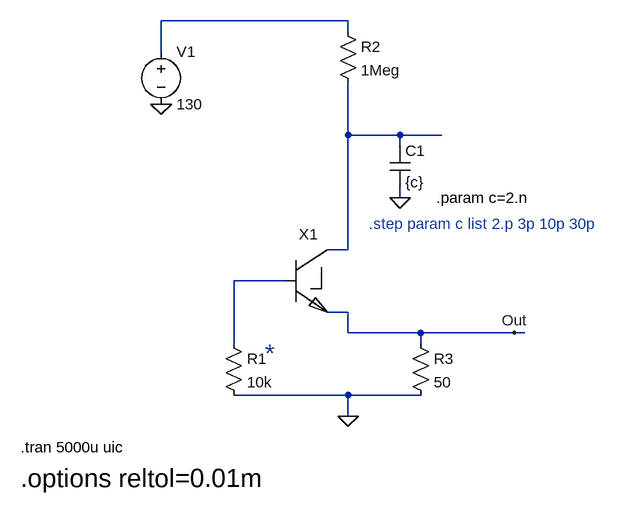
[diagram p0: schematic Ex2_2N2369A.asc]
Ex2_2N2369A.asc, the LTspice schematic file:
Version 4
SHEET 1 4432 680
WIRE 1440 -304 1152 -304
WIRE 1440 -288 1440 -304
WIRE 1152 -256 1152 -304
WIRE 1440 -128 1440 -208
WIRE 1520 -128 1440 -128
WIRE 1584 -128 1520 -128
WIRE 1520 -112 1520 -128
WIRE 1520 -32 1520 -48
WIRE 1440 48 1440 -128
WIRE 1440 48 1408 48
WIRE 1344 96 1264 96
WIRE 1440 144 1408 144
WIRE 1440 176 1440 144
WIRE 1552 176 1440 176
WIRE 1696 176 1552 176
WIRE 1712 176 1696 176
WIRE 1264 192 1264 96
WIRE 1552 192 1552 176
WIRE 1440 272 1264 272
WIRE 1552 272 1440 272
WIRE 1440 304 1440 272
FLAG 1440 304 0
FLAG 1152 -176 0
FLAG 1520 -32 0
FLAG 1696 176 Out
SYMBOL res 1248 176 R0
SYMATTR InstName R1
SYMATTR Value 10k
SYMBOL res 1424 -304 R0
SYMATTR InstName R2
SYMATTR Value 1Meg
SYMBOL voltage 1152 -272 R0
WINDOW 123 0 0 Left 2
WINDOW 39 0 0 Left 2
SYMATTR InstName V1
SYMATTR Value 130
SYMBOL res 1536 176 R0
SYMATTR InstName R3
SYMATTR Value 50
SYMBOL 2N2369A_Avalanche 1376 96 R0
SYMATTR InstName X1
SYMBOL cap 1504 -112 R0
SYMATTR InstName C1
SYMATTR Value {c}
TEXT 936 352 Left 2 !.tran 5000u uic
TEXT 936 400 Left 4 !.options reltol=0.01m
TEXT 1312 208 Left 4 ;*
TEXT 1472 8 Left 2 ;.step param c list 2.p 3p 10p 30p
TEXT 1576 -32 Left 2 !.param c=2.n

The netlist it stands for:
* Ex2_2N2369A.asc
R1 N003 0 10k
R2 N001 N002 1Meg
V1 N001 0 130
R3 Out 0 50
XX1 N003 N002 Out 2N2369A_Avalanche  ; pins B C E
C1 N002 0 {c}
.tran 5000u uic
.options reltol=0.01m
* *
* .step param c list 2.p 3p 10p 30p
.param c=2.n
.backanno
.end